# EasyEDA schematic 1-Schematic_SELE_SPI.json
TITLE: SELE - PDC8544; REV: 1.1; Date: 2020-03-24; Sheet: 1/1; Drawn By: Diogo Correia & Pedro Augusto; Company: FEUP
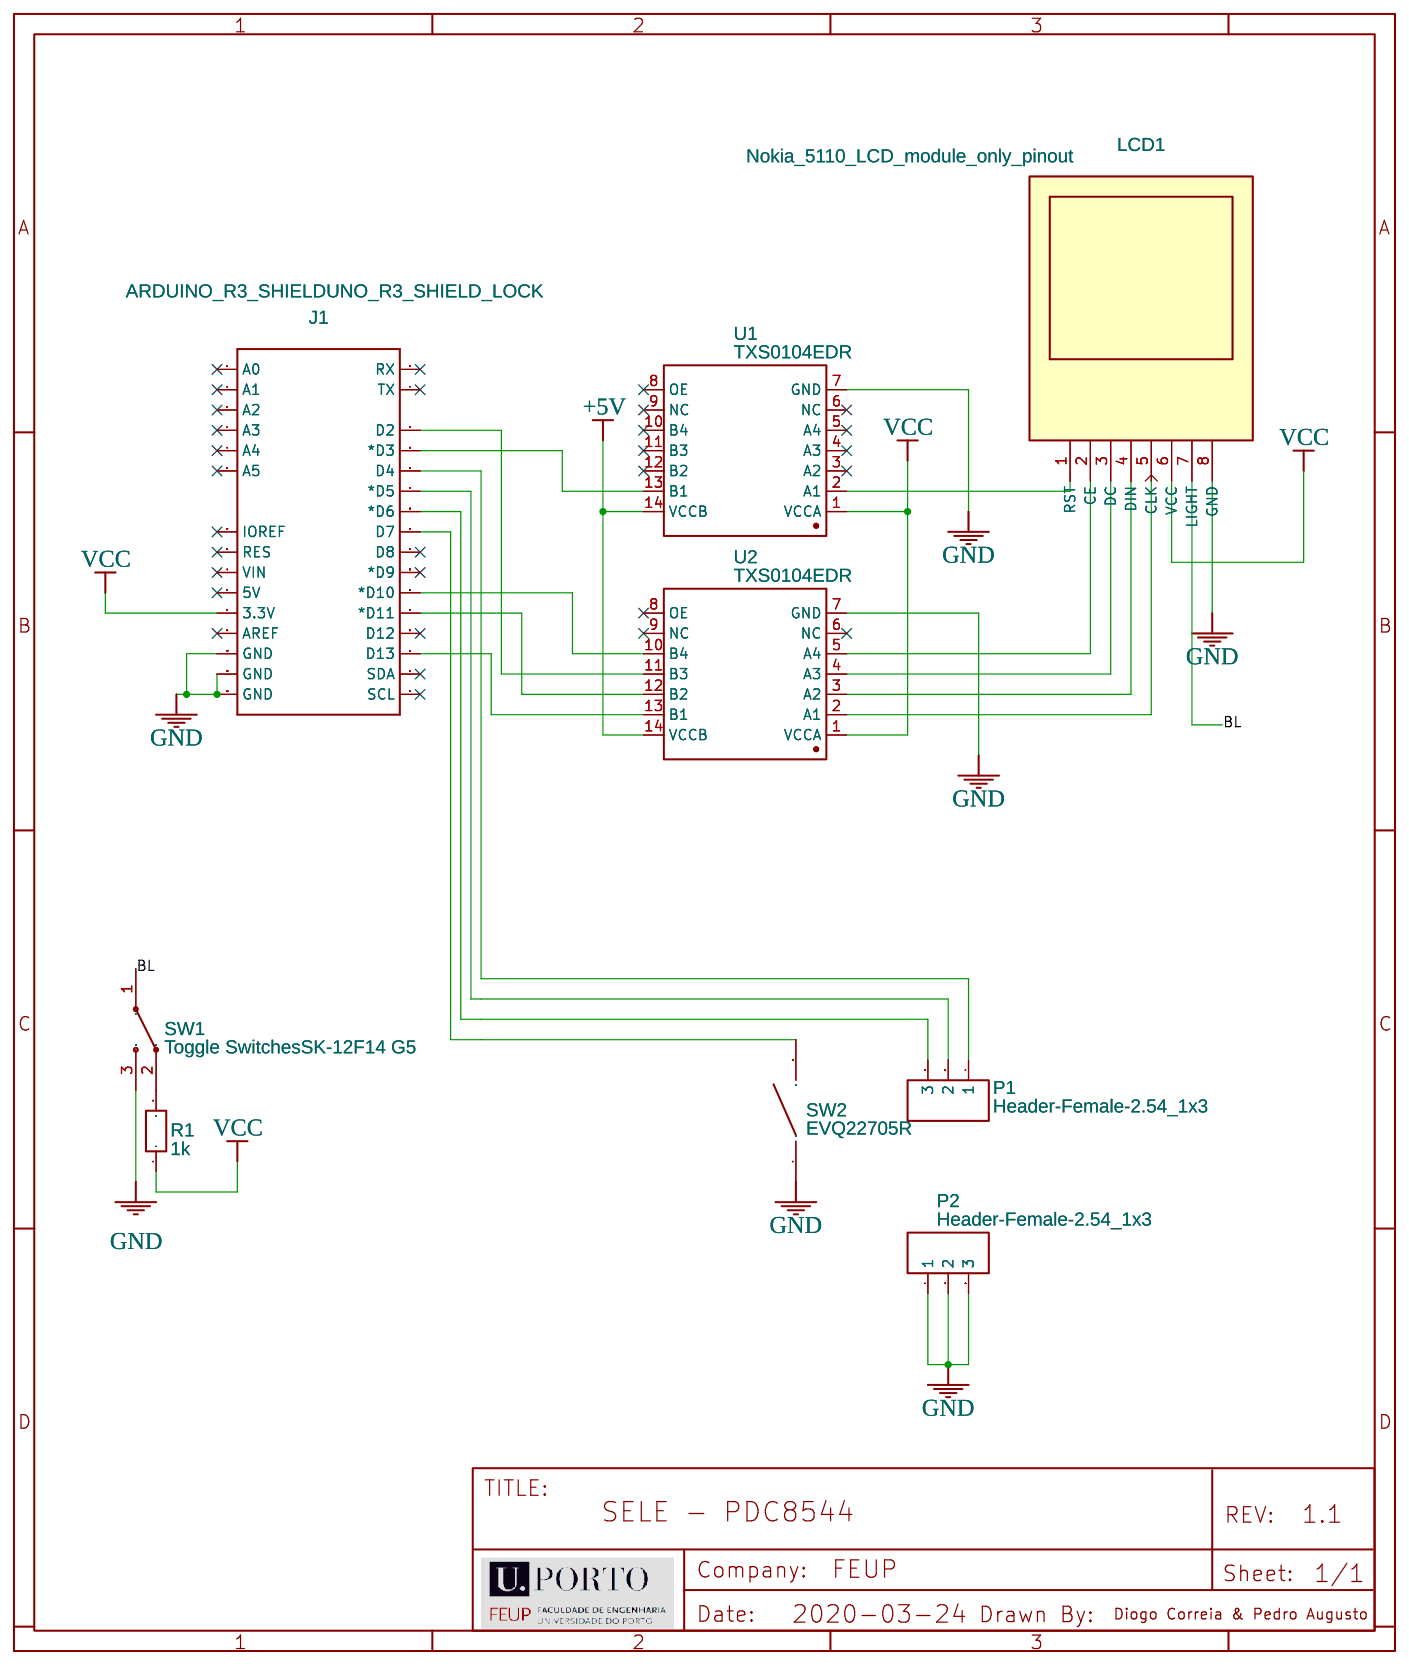
[diagram p0: schematic sheet]

## Parts
J1  ARDUINO_R3_SHIELDUNO_R3_SHIELD_LOCK  [UNO_R3_SHIELD_LOCK]
LCD1  Nokia_5110_LCD_module_only_pinout  [NOKIA_5110_ONLY_PINS]
P1  Header-Female-2.54_1x3  [HDR-TH_3P-P2.54-V]
P2  Header-Female-2.54_1x3  [HDR-TH_3P-P2.54-V]
R1  1k  [AXIAL-0.3]
SW1  Toggle SwitchesSK-12F14 G5  [SK-12F14-G]
SW2  EVQ22705R  [KEY-6.0*6.0-4]
U1  TXS0104EDR  [SOIC-14_L8.7-W3.9-P1.27-LS6.0-BL]
U2  TXS0104EDR  [SOIC-14_L8.7-W3.9-P1.27-LS6.0-BL]

## Library data of the parts
J1 = -: Shield form compatible with the Arduino Uno R3.; Contributor: SparkFun
LCD1 = Nokia_5110_LCD_module_only_pinout: sourceId: SsmEWewN5; Contributor: dangebhardt; Package Display: No
P1 P2 = Header-Female-2.54_1x3: Supplier Part: C146243; Supplier: LCSC; Manufacturer: Boom Precision Elec; link: https://datasheet.lcsc.com/szlcsc/Boom-Precision-Elec-2-54mm-1-8P-Straight-Female-header_C27438.pdf
R1 = Res_AXIAL-0.3(1/8W)_EU
SW1 = Toggle SwitchesSK-12F14 G5: Supplier Part: C59902; Supplier: LCSC; Manufacturer: ReliaPro; image: http://image.lceda.cn/szlcsc/C59902.jpg
SW2 = EVQ22705R: Supplier: LCSC; Manufacturer: PANASONIC; Contributor: LCSC; Supplier Part: C79156
U1 U2 = TXS0104EDR: Supplier: LCSC; Manufacturer: TI; Contributor: LCSC; Supplier Part: C79342; LCSC Assembly: Yes; SMT Type: Extend

## Nets
+5V: U1.14(VCCB) U2.14(VCCB)
GND: J1.GND@0(GND) J1.GND@1(GND) J1.GND@2(GND) LCD1.8(GND) P2.1 P2.2 P2.3 SW1.3 SW2.1 U1.7(GND) U2.7(GND)
VCC: J1.3.3V LCD1.6(VCC) R1.1 U1.1(VCCA) U2.1(VCCA)
BL: LCD1.7(LIGHT) SW1.1
Net-(J1-D2): J1.D2 U2.11(B3)
Net-(J1-D3): J1.D3(*D3) U1.13(B1)
Net-(J1-D4): J1.D4 P1.1
Net-(J1-D5): J1.D5(*D5) P1.2
Net-(J1-D6): J1.D6(*D6) P1.3
Net-(J1-D7): J1.D7 SW2.2
Net-(J1-D10): J1.D10(*D10) U2.10(B4)
Net-(J1-D11): J1.D11(*D11) U2.12(B2)
Net-(J1-D13): J1.D13 U2.13(B1)
Net-(LCD1-1): LCD1.1(RST) U1.2(A1)
Net-(LCD1-2): LCD1.2(CE) U2.5(A4)
Net-(LCD1-3): LCD1.3(DC) U2.4(A3)
Net-(LCD1-4): LCD1.4(DIN) U2.3(A2)
Net-(LCD1-5): LCD1.5(CLK) U2.2(A1)
Net-(R1-2): R1.2 SW1.2

Not connected (* = marked no-connect by the designer): J1 5V* A0* A1* A2* A3* A4* A5* AREF* D8* D9(*D9)* D12* IOREF* RES* RX* SCL* SDA* TX* VIN*; U1 3(A2)* 4(A3)* 5(A4)* 6(NC)* 8(OE)* 9(NC)* 10(B4)* 11(B3)* 12(B2)*; U2 6(NC)* 8(OE)* 9(NC)*
